# Altium project L6562_pfC_V0.1.PrjPcb
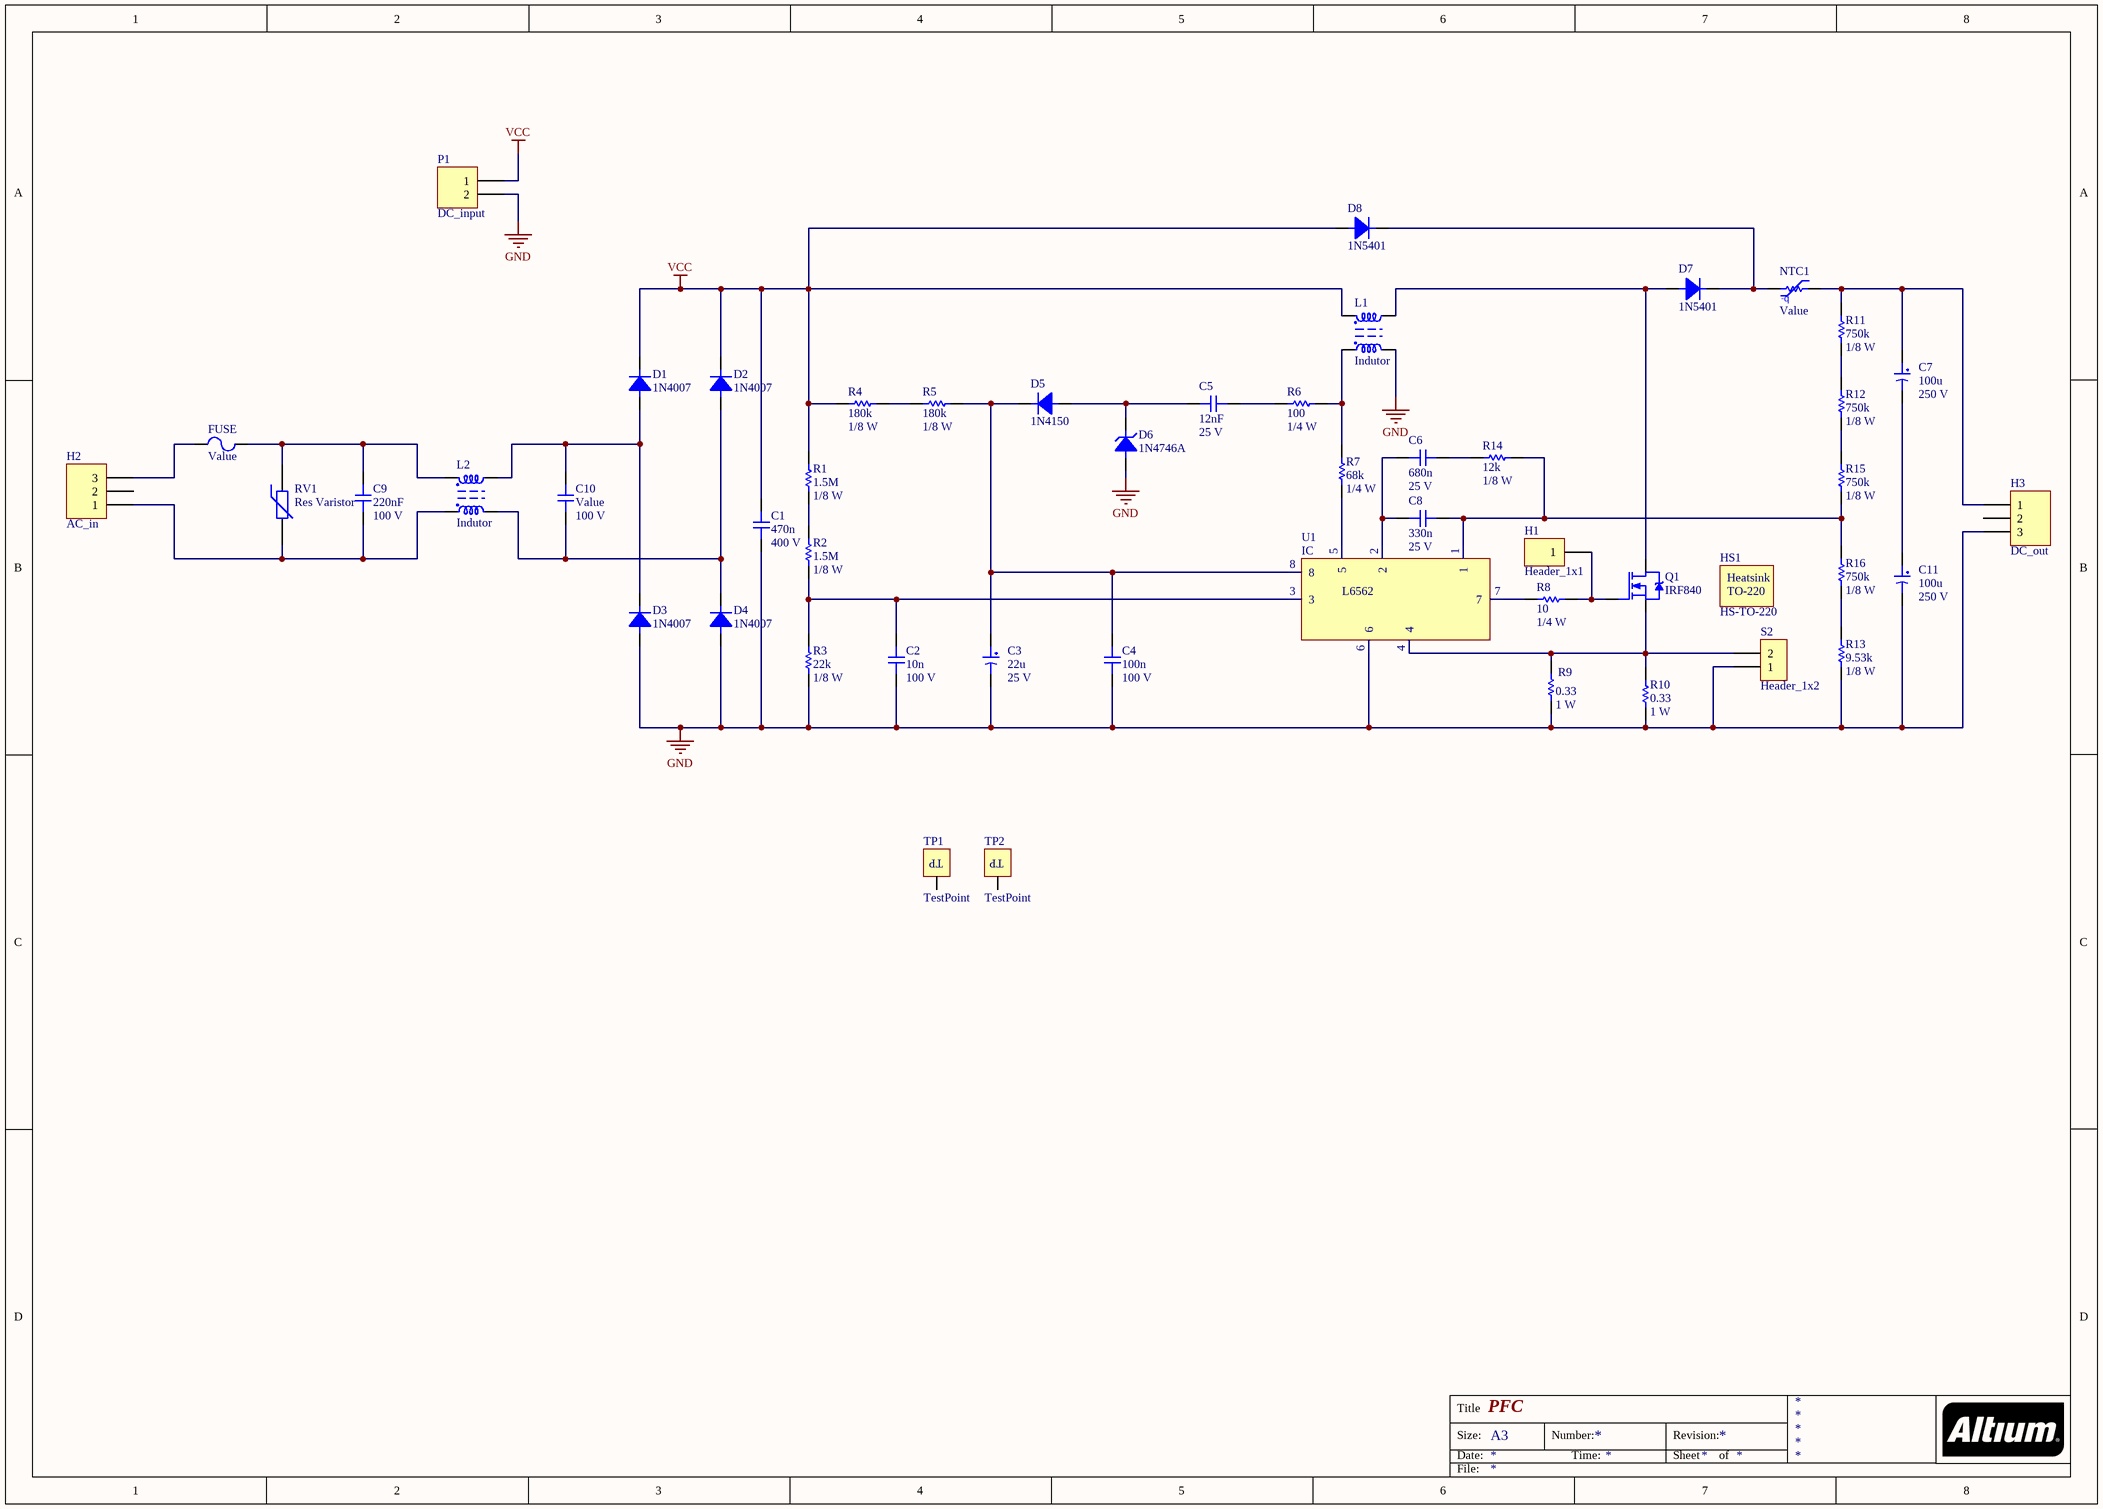
[diagram p0: Sheet1.SchDoc]
1 sheet, 50 parts. Net scope: global (net labels, ports and power ports of the same name join across sheets).
Board files: PCB_PFC_V01.PcbDoc, PCB1.PcbDoc

## Sheet Sheet1.SchDoc: PFC
size A3

### Parts
C1  470n  Voltage: 400 V  [AXIAL-1.0]
C2  10n  Voltage: 100 V  [0805C]
C3  22u  Voltage: 25 V  [CP-5.0mm-11.0mm-2.0mm]
C4  100n  Voltage: 100 V  [0805C]
C5  12nF  Voltage: 25 V  [C100-200-100]
C6  680n  Voltage: 25 V  [C200-350-150]
C7  100u  Voltage: 250 V  [CP-16.0mm-25.0mm-7.5mm]
C8  330n  Voltage: 25 V  [C200-350-150]
C9  220nF  Voltage: 100 V  [C590-695-330]
C10  Value  Voltage: 100 V  [C590-695-330]
C11  100u  Voltage: 250 V  [CP-16.0mm-25.0mm-7.5mm]
D1  1N4007  [DO-41-Plastic]
D2  1N4007  [DO-41-Plastic]
D3  1N4007  [DO-41-Plastic]
D4  1N4007  [DO-41-Plastic]
D5  1N4150  [DO-35-Glass]
D6  1N4746A  [DO-41-Glass]
D7  1N5401  [DO-201-Plastic]
D8  1N5401  [DO-201-Plastic]
FUSE  Value  [Fuse]
H1  Header_1x1  [HDR1X1]
H2  AC_in  [TB03]
H3  DC_out  [TB03]
HS1  HS-TO-220  [HS-TO-220-183012]
L1  Indutor  [TRZ30.010.1]
L2  Indutor  [IndutorAcoplado]
NTC1  Value  [Thermistor-315mil]
P1  DC_input  [KRE_2]
Q1  IRF840  [TO-220/123]
R1  1.5M  Power: 1/8 W  [0805R]
R2  1.5M  Power: 1/8 W  [0805R]
R3  22k  Power: 1/8 W  [0805R]
R4  180k  Power: 1/8 W  [0805R]
R5  180k  Power: 1/8 W  [0805R]
R6  100  Power: 1/4 W  [R400-2.0mm]
R7  68k  Power: 1/4 W  [R400-2.0mm]
R8  10  Power: 1/4 W  [R400-2.0mm]
R9  0.33  Power: 1 W  [R-AC01]
R10  0.33  Power: 1 W  [R-AC01]
R11  750k  Power: 1/8 W  [0805R]
R12  750k  Power: 1/8 W  [0805R]
R13  9.53k  Power: 1/8 W  [0805R]
R14  12k  Power: 1/8 W  [0805R]
R15  750k  Power: 1/8 W  [0805R]
R16  750k  Power: 1/8 W  [0805R]
RV1  Res Varistor  [C400-550-150]
S2  Header_1x2  [HDR-M-1x2-2.54mm-180-9.2mm]
TP1  TestPoint  [FD]
TP2  TestPoint  [FD]
U1  IC  [SO8_L]

### Nets
GND: C1.2 C2.2 C3.2 C4.2 C11.2 D3.A D4.A D6.A H3.3 L1.4 P1.2 R3.1 R9.2 R10.2 R13.1 S2.1 U1.6
VCC: C1.1 D1.K D2.K D8.A L1.1 P1.1 R1.1 R4.1
NetC2_1: C2.1 R2.2 R3.2 U1.3
NetC3_1: C3.1 C4.1 D5.K R5.2 U1.8
NetC5_1: C5.1 D5.A D6.K
NetC5_2: C5.2 R6.1
NetC6_1: C6.1 C8.1 U1.2
NetC6_2: C6.2 R14.2
NetC7_1: C7.1 H3.1 NTC1.2 R11.2
NetC7_2: C7.2 C11.1
NetC8_2: C8.2 R14.1 R15.1 R16.2 U1.1
NetC9_1: C9.1 FUSE.2 L2.1 RV1.1
NetC9_2: C9.2 H2.1 L2.3 RV1.2
NetC10_1: C10.1 D2.A D4.K L2.4
NetC10_2: C10.2 D1.A D3.K L2.2
NetD7_A: D7.A L1.2 Q1.D
NetD7_K: D7.K D8.K NTC1.1
NetFUSE_1: FUSE.1 H2.3
NetH1_1: H1.1 Q1.G R8.2
NetL1_3: L1.3 R6.2 R7.2
NetQ1_S: Q1.S R9.1 R10.1 S2.2 U1.4
NetR1_2: R1.2 R2.1
NetR4_2: R4.2 R5.1
NetR7_1: R7.1 U1.5
NetR8_1: R8.1 U1.7
NetR11_1: R11.1 R12.2
NetR12_1: R12.1 R15.2
NetR13_2: R13.2 R16.1

Not connected (* = marked no-connect by the designer): H2 2; H3 2; TP1 1(TP); TP2 1(TP)

### Notes on the sheet
- Title
- Size:
- Date:
- A3
- Number:
- Time:
- Revision:
- Sheet
- of
- File:
- (in symbol HS-TO-220) Heatsink; TO-220
- (in symbol NTC) -q

### Library data of the parts
C1 C2 C4-C6 C8-C10 = Capacitor: Published: 8-Jun-2000; LatestRevisionDate: 17-Jul-2002; LatestRevisionNote: Re-released for DXP Platform.; PackageReference: RAD-0.3; Publisher: Altium Limited
C3 C7 C11 = Capacitor-Electrolytic: Electrolytic Capacitor
D1-D4 = 1N4007: General Purpose Rectifier; Peak Repetitive Reverse Voltage (Vrrm): 1000 V; Forward Current (If): 1 A; Non-Repetitive Peak Forward Surge Current (Ifsm): 30 A; Forward Voltage (Vf): 1.1 V; Reverse Current (Ir): 5 uA; Total Capacitance (Ct): 15 pF
D5 = 1N914A: Small Signal Diode; Peak Repetitive Reverse Voltage (Vrrm): 100 V; Forward Current (If): 300 mA; Non-Repetitive Peak Forward Surge Current (Ifsm): 1 A; Forward Voltage (Vf): 1 V; Reverse Current (Ir): 25 nA; Total Capacitance (Ct): 4 pF; Max Recovery Time (trr): 4ns
D6 = 1N4746A: Zener Diode; Zener Voltage (Vz): 18 V; Zener Current (Iz): 50 mA; Power Dissipation (Pd): 1.3 W; Forward Voltage (Vf): 1.2 V
D7 D8 = 1N5401: 3 Amp Rectifier; Forward Current (If): 3 A; Forward Voltage (Vf): 1 V; Non-Repetitive Peak Forward Surge Current (Ifsm): 200 A; Peak Repetitive Reverse Voltage (Vrrm): 100 V; Reverse Current (Ir): 10 uA; Total Capacitance (Ct): 50 pF
FUSE = FUSE: Negative Temperature Coefficient Thermistor
H1 = Header_1x1: Header 1 Line 1 Pin; LatestRevisionDate: 17-Jul-2002; LatestRevisionNote: Re-released for DXP Platform.; Publisher: Altium Limited
H2 H3 = Terminal_1x3: Bloco terminal 1x3
HS1 = HS-TO-220: Heatsink TO-220
L1 L2 = Indutor: Indutor Acoplado - Filtro EMI
NTC1 = NTC: Negative Temperature Coefficient Thermistor
P1 = KRE_2: Terminal Block 1x2
Q1 = IRFZ46N: HEXFET Power MOSFET; pin to pad: D>2 G>1 S>3; Drain Current (Id): 53 A; Drain Current Peak (Idp): 180 A; Power Dissipation (Pd): 107 W; Gate-to-Source Voltage (Vgs): 20 V; Static Drain-to-Source On-Resistance (Rdson): 16.5 mR; Turn-On Delay (tdon): 14 ns; Rise Time (Rt): 76 ns; Fall Time (Tf): 57 ns; Turn-Off Delay (Tdoff): 52 ns
R1-R8 R11-R16 = Resistor: Tolerance: 5%; Published: 8-Jun-2000; LatestRevisionDate: 17-Jul-2002; LatestRevisionNote: Re-released for DXP Platform.; PackageReference: AXIAL-0.3; Publisher: Altium Limited
R9 R10 = ResistorPower: Power Resistor; Tolerance: 5%; Published: 8-Jun-2000; LatestRevisionDate: 17-Jul-2002; LatestRevisionNote: Re-released for DXP Platform.; PackageReference: AXIAL-0.3; Publisher: Altium Limited
RV1 = Res Varistor: Varistor (Voltage-Sensitive Resistor); Published: 24-Mar-1999; LatestRevisionDate: 29-May-2009; LatestRevisionNote: IPC-7351 Footprint Added.; PackageVersion: Mar-2003; PackageReference: 6-0805; Publisher: Altium Limited; PackageDescription: Chip Resistor 0805 Case Size; Code_IPC: RESC2012
S2 = Header_1x2: Header, 1 Line, 2 Columns, 2 Pins; LatestRevisionDate: 17-Jul-2002; LatestRevisionNote: Re-released for DXP Platform.; Publisher: Altium Limited
TP1 TP2 = TestPoint: Test Point
U1 = L6562: PFC Controller